# Altium schematic sheet No.2 运放板.SchDoc
size A4
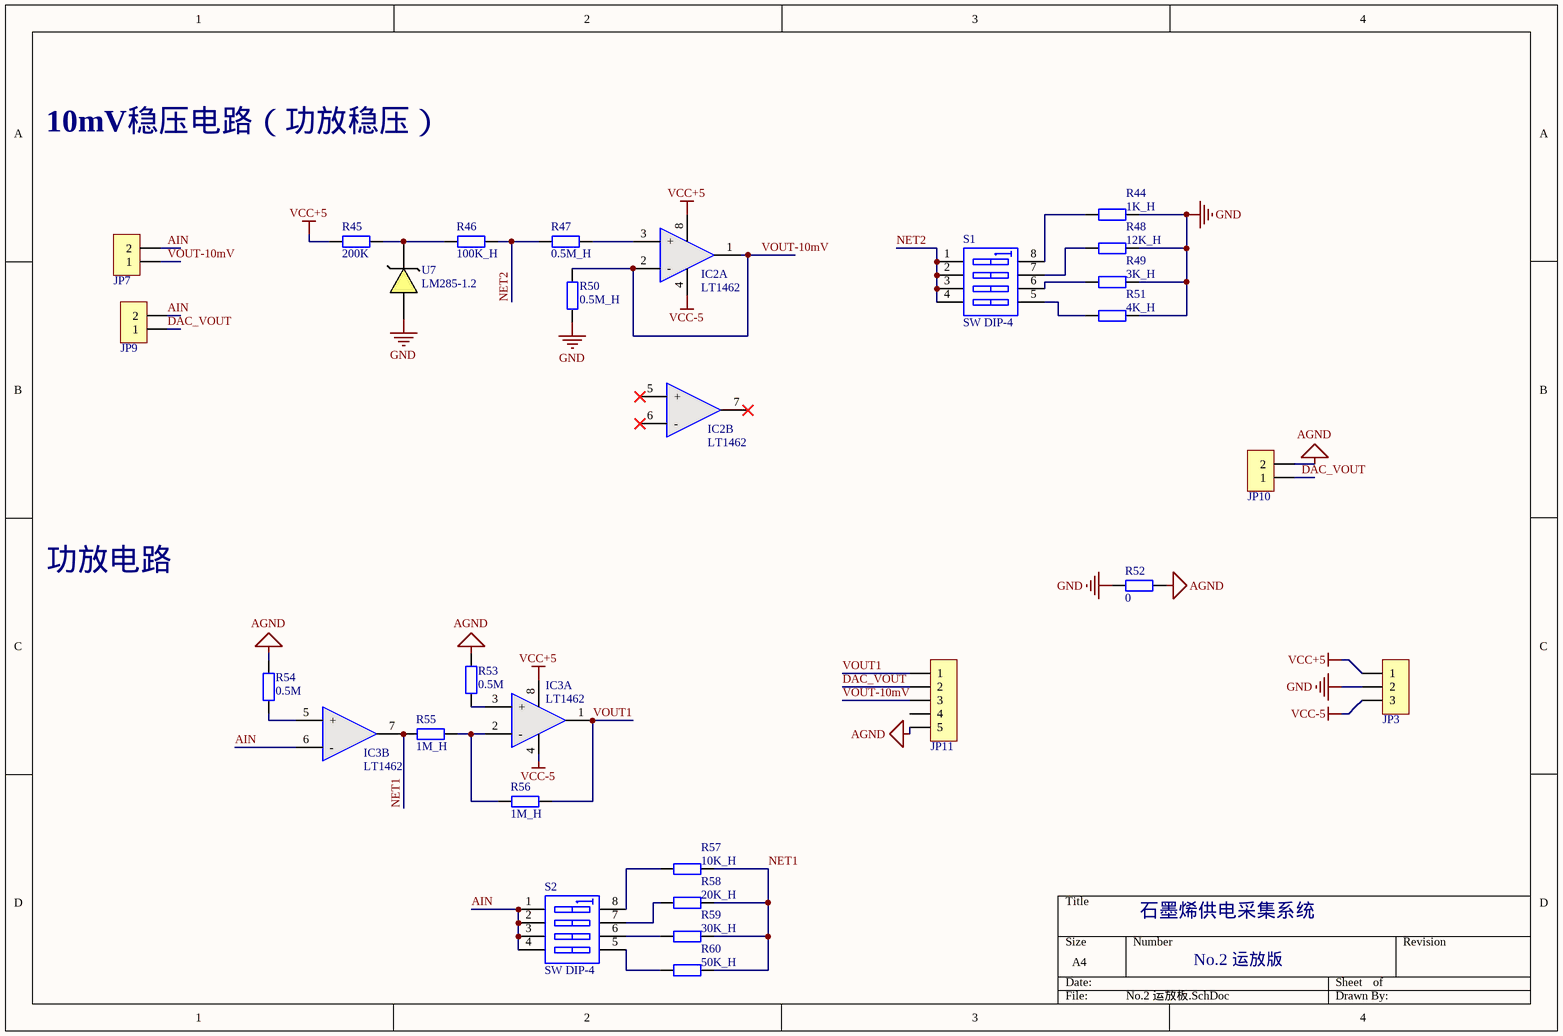
[diagram p0: No.2 运放板.SchDoc]

## Parts
IC2  LT1462  [SOP8_N]  (parts A,B of 2)
IC3  LT1462  [SOP8_N]  (parts A,B of 2)
JP3  HDR-1X3  [XH2.54-WI-3P]  (value not drawn)
JP7  HDR-1X2  [XH2.54-WI-2P]  (value not drawn)
JP9  HDR-1X2  [XH2.54-WI-2P]  (value not drawn)
JP10  HDR-1X2  [XH2.54-WI-2P]  (value not drawn)
JP11  HDR-1X5  [XH2.54-WI-5P]  (value not drawn)
R44  1K_H  [RS 1/4W]
R45  200K  [R 0805_M]
R46  100K_H  [RS 1/4W]
R47  0.5M_H  [RS 1/4W]
R48  12K_H  [RS 1/4W]
R49  3K_H  [RS 1/4W]
R50  0.5M_H  [RS 1/4W]
R51  4K_H  [RS 1/4W]
R52  0  [R 0805_M]
R53  0.5M  [R 0805_M]
R54  0.5M  [R 0805_M]
R55  1M_H  [RS 1/4W]
R56  1M_H  [RS 1/4W]
R57  10K_H  [RS 1/4W]
R58  20K_H  [RS 1/4W]
R59  30K_H  [RS 1/4W]
R60  50K_H  [RS 1/4W]
S1  SW DIP-4  [SO-8M]
S2  SW DIP-4  [SO-8M]
U7  LM285-1.2  [TO92A]

## Nets
AGND: JP10.2 JP11.5 R52.2 R53.1 R54.1
GND: JP3.2 R44.2 R48.2 R49.2 R50.1 R51.2 R52.1 U7.3(ANODE)
VCC+5: IC2.8(V+) IC3.8(V+) JP3.1 R45.1
VCC-5: IC2.4(V-) IC3.4(V-) JP3.3
AIN: IC3.6(-) JP7.2 JP9.2 S2.1(A1) S2.2(A2) S2.3(A3) S2.4(A4)
DAC_VOUT: JP9.1 JP10.1 JP11.2
NET1: IC3.7(OUT2) R55.1 R57.2 R58.2 R59.2 R60.2
NET2: R46.2 R47.1 S1.1(A1) S1.2(A2) S1.3(A3) S1.4(A4)
VOUT1: IC3.1(OUT1) JP11.1 R56.2
VOUT-10mV: IC2.1(OUT1) IC2.2(-) JP7.1 JP11.3 R50.2
NetIC2_3: IC2.3(+) R47.2
NetIC3_2: IC3.2(-) R55.2 R56.1
NetIC3_3: IC3.3(+) R53.2
NetIC3_5: IC3.5(+) R54.2
NetR44_1: R44.1 S1.8(B1)
NetR45_2: R45.2 R46.1 U7.2(CATHODE)
NetR48_1: R48.1 S1.7(B2)
NetR49_1: R49.1 S1.6(B3)
NetR51_1: R51.1 S1.5(B4)
NetR57_1: R57.1 S2.8(B1)
NetR58_1: R58.1 S2.7(B2)
NetR59_1: R59.1 S2.6(B3)
NetR60_1: R60.1 S2.5(B4)

Not connected (* = marked no-connect by the designer): IC2 5(+)* 6(-)* 7(OUT2)*; JP11 4

## Notes on the sheet
- 10mV稳压电路（功放稳压）
- 功放电路
- 石墨烯供电采集系统
- No.2 运放版

## Library data of the parts
IC2 IC3 = LT1678: 双运放; 版权归属: 源创客; BOM名称: 双运放; 学习资源: www.ooocke.com
JP3 = Header 3: 3P接插件; 版权归属: 源创客; BOM名称: 3P接插件; 学习资源: www.ooocke.com
JP7 JP9 JP10 = Header 2: 2P接插件; 版权归属: 源创客; BOM名称: 2P接插件; 学习资源: www.ooocke.com
JP11 = Header 5: 5P接插件; 版权归属: 源创客; BOM名称: 5P接插件; 学习资源: www.ooocke.com
R44-R60 = R: 贴片电阻; 版权归属: 源创客; BOM名称: 贴片电阻; 学习资源: www.ooocke.com
S1 S2 = SW DIP-4: DIP Switch, 4 Position, SPST; Published: 24-Mar-1999; LatestRevisionDate: 17-Jul-2002; LatestRevisionNote: Re-released for DXP Platform.; PackageReference: SO8; Publisher: Altium Limited; Code_JEDEC: MS-012-AA; Code_IPC: SO8